# EAGLE design PinscapePico KL25Z Adapter - PCA9555 vsn (EAGLE 7.7.0)

## Sheet 1 of 4: Main
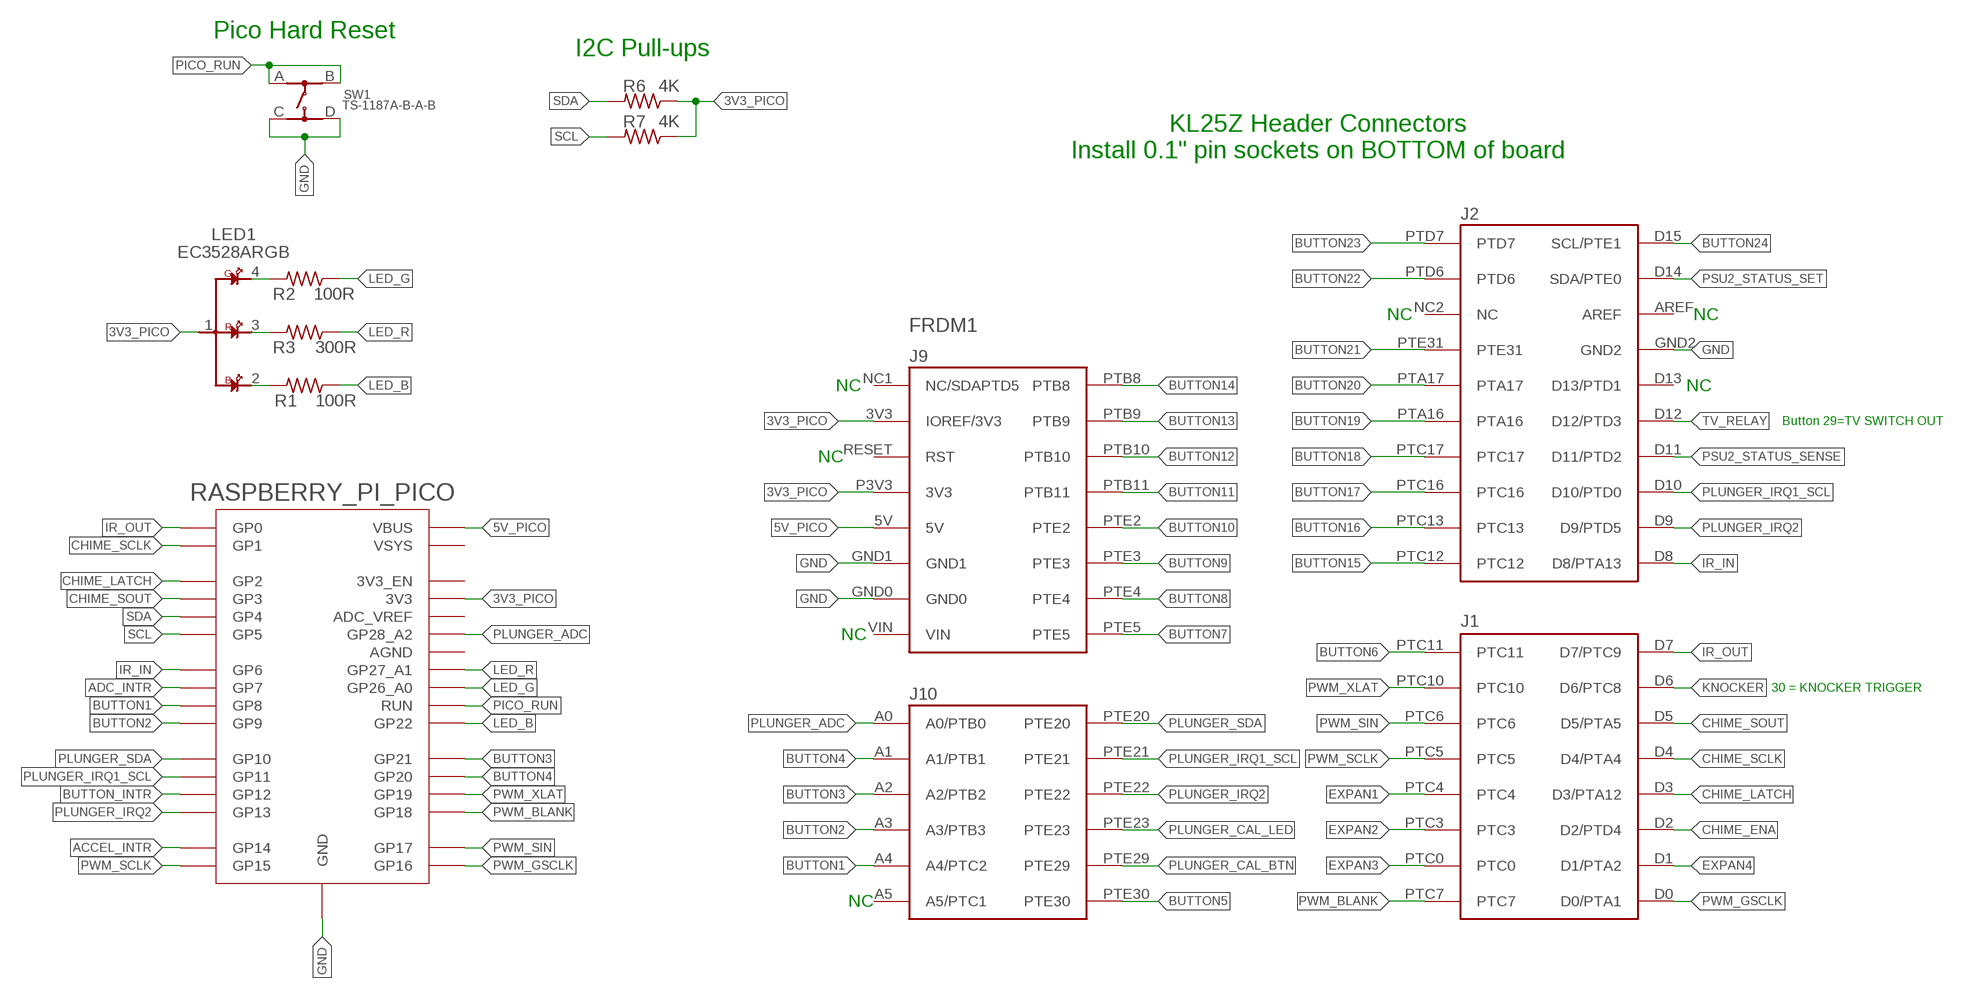
[diagram p0: schematic, sheet 1]

### Parts
FRDM1  KL25Z  FRDM-KL25ZNORMAL  [FRDM_KL25Z_NORMAL]
LED1  EC3528ARGB  [EC3528ARGB]
R1  100R  R-US_R1206  [R1206]
R2  100R  R-US_R1206  [R1206]
R3  300R  R-US_R1206  [R1206]
R6  4K  R-US_R1206  [R1206]
R7  4K  R-US_R1206  [R1206]
RASPBERRY_PI_PICO  RPI_PICO_NO_DEBUG  [RPI_PICO_TH_NO_DEBUG]
SW1  TS-1187A-B-A-B  [TS-1187A-B-A-B]

### Nets
3V3_PICO: FRDM1.3V3(IOREF/3V3) FRDM1.P3V3(3V3) LED1.1 R6.1 R7.1 RASPBERRY_PI_PICO.3V3 ; also sheet 2,3,4
5V_PICO: FRDM1.5V RASPBERRY_PI_PICO.VBUS
ACCEL_INTR: RASPBERRY_PI_PICO.GP14 ; also sheet 3
ADC_INTR: RASPBERRY_PI_PICO.GP7 ; also sheet 4
BUTTON1: FRDM1.A4(A4/PTC2) RASPBERRY_PI_PICO.GP8
BUTTON2: FRDM1.A3(A3/PTB3) RASPBERRY_PI_PICO.GP9
BUTTON3: FRDM1.A2(A2/PTB2) RASPBERRY_PI_PICO.GP21
BUTTON4: FRDM1.A1(A1/PTB1) RASPBERRY_PI_PICO.GP20
BUTTON5: FRDM1.PTE30 ; also sheet 2
BUTTON6: FRDM1.PTC11 ; also sheet 2
BUTTON7: FRDM1.PTE5 ; also sheet 2
BUTTON8: FRDM1.PTE4 ; also sheet 2
BUTTON9: FRDM1.PTE3 ; also sheet 2
BUTTON10: FRDM1.PTE2 ; also sheet 2
BUTTON11: FRDM1.PTB11 ; also sheet 2
BUTTON12: FRDM1.PTB10 ; also sheet 2
BUTTON13: FRDM1.PTB9 ; also sheet 2
BUTTON14: FRDM1.PTB8 ; also sheet 2
BUTTON15: FRDM1.PTC12 ; also sheet 2
BUTTON16: FRDM1.PTC13 ; also sheet 2
BUTTON17: FRDM1.PTC16 ; also sheet 2
BUTTON18: FRDM1.PTC17 ; also sheet 2
BUTTON19: FRDM1.PTA16 ; also sheet 2
BUTTON20: FRDM1.PTA17 ; also sheet 2
BUTTON21: FRDM1.PTE31 ; also sheet 2
BUTTON22: FRDM1.PTD6 ; also sheet 2
BUTTON23: FRDM1.PTD7 ; also sheet 2
BUTTON24: FRDM1.D15(SCL/PTE1) ; also sheet 2
BUTTON_INTR: RASPBERRY_PI_PICO.GP12 ; also sheet 2
CHIME_ENA: FRDM1.D2(D2/PTD4) ; also sheet 2
CHIME_LATCH: FRDM1.D3(D3/PTA12) RASPBERRY_PI_PICO.GP2
CHIME_SCLK: FRDM1.D4(D4/PTA4) RASPBERRY_PI_PICO.GP1
CHIME_SOUT: FRDM1.D5(D5/PTA5) RASPBERRY_PI_PICO.GP3
EXPAN1: FRDM1.PTC4 ; also sheet 2
EXPAN2: FRDM1.PTC3 ; also sheet 2
EXPAN3: FRDM1.PTC0 ; also sheet 2
EXPAN4: FRDM1.D1(D1/PTA2) ; also sheet 2
GND: FRDM1.GND0 FRDM1.GND1 FRDM1.GND2 RASPBERRY_PI_PICO.GND@1(GND) RASPBERRY_PI_PICO.GND@2(GND) RASPBERRY_PI_PICO.GND@3(GND) RASPBERRY_PI_PICO.GND@4(GND) RASPBERRY_PI_PICO.GND@6(GND) RASPBERRY_PI_PICO.GND@7(GND) RASPBERRY_PI_PICO.GND@8(GND) SW1.C SW1.D ; also sheet 2,3,4
IR_IN: FRDM1.D8(D8/PTA13) RASPBERRY_PI_PICO.GP6
IR_OUT: FRDM1.D7(D7/PTC9) RASPBERRY_PI_PICO.GP0
KNOCKER: FRDM1.D6(D6/PTC8) ; also sheet 2
LED_B: R1.1 RASPBERRY_PI_PICO.GP22
LED_G: R2.1 RASPBERRY_PI_PICO.GP26_A0
LED_R: R3.1 RASPBERRY_PI_PICO.GP27_A1
N$8: LED1.3 R3.2
N$10: LED1.2 R1.2
N$13: LED1.4 R2.2
PICO_RUN: RASPBERRY_PI_PICO.RUN SW1.A SW1.B
PLUNGER_ADC: FRDM1.A0(A0/PTB0) RASPBERRY_PI_PICO.GP28_A2 ; also sheet 4
PLUNGER_CAL_BTN: FRDM1.PTE29 ; also sheet 2
PLUNGER_CAL_LED: FRDM1.PTE23 ; also sheet 2
PLUNGER_IRQ1_SCL: FRDM1.D10(D10/PTD0) FRDM1.PTE21 RASPBERRY_PI_PICO.GP11
PLUNGER_IRQ2: FRDM1.D9(D9/PTD5) FRDM1.PTE22 RASPBERRY_PI_PICO.GP13
PLUNGER_SDA: FRDM1.PTE20 RASPBERRY_PI_PICO.GP10
PSU2_STATUS_SENSE: FRDM1.D11(D11/PTD2) ; also sheet 2
PSU2_STATUS_SET: FRDM1.D14(SDA/PTE0) ; also sheet 2
PWM_BLANK: FRDM1.PTC7 RASPBERRY_PI_PICO.GP18
PWM_GSCLK: FRDM1.D0(D0/PTA1) RASPBERRY_PI_PICO.GP16
PWM_SCLK: FRDM1.PTC5 RASPBERRY_PI_PICO.GP15
PWM_SIN: FRDM1.PTC6 RASPBERRY_PI_PICO.GP17
PWM_XLAT: FRDM1.PTC10 RASPBERRY_PI_PICO.GP19
SCL: R7.2 RASPBERRY_PI_PICO.GP5 ; also sheet 2,3,4
SDA: R6.2 RASPBERRY_PI_PICO.GP4 ; also sheet 2,3,4
TV_RELAY: FRDM1.D12(D12/PTD3) ; also sheet 2
Unconnected: FRDM1.A5(A5/PTC1) FRDM1.AREF FRDM1.D13(D13/PTD1) FRDM1.NC1(NC/SDAPTD5) FRDM1.NC2(NC) FRDM1.RESET(RST) FRDM1.VIN RASPBERRY_PI_PICO.3V3_EN RASPBERRY_PI_PICO.ADC_VREF RASPBERRY_PI_PICO.AGND RASPBERRY_PI_PICO.VSYS

### Notes on the sheet
- Pico Hard Reset
- I2C Pull-ups
- KL25Z Header Connectors
  Install 0.1" pin sockets on BOTTOM of board
- NC | NC
- NC | NC
- Button 29=TV SWITCH OUT
- NC
- NC
- 30 = KNOCKER TRIGGER
- NC

## Sheet 2 of 4: Buttons
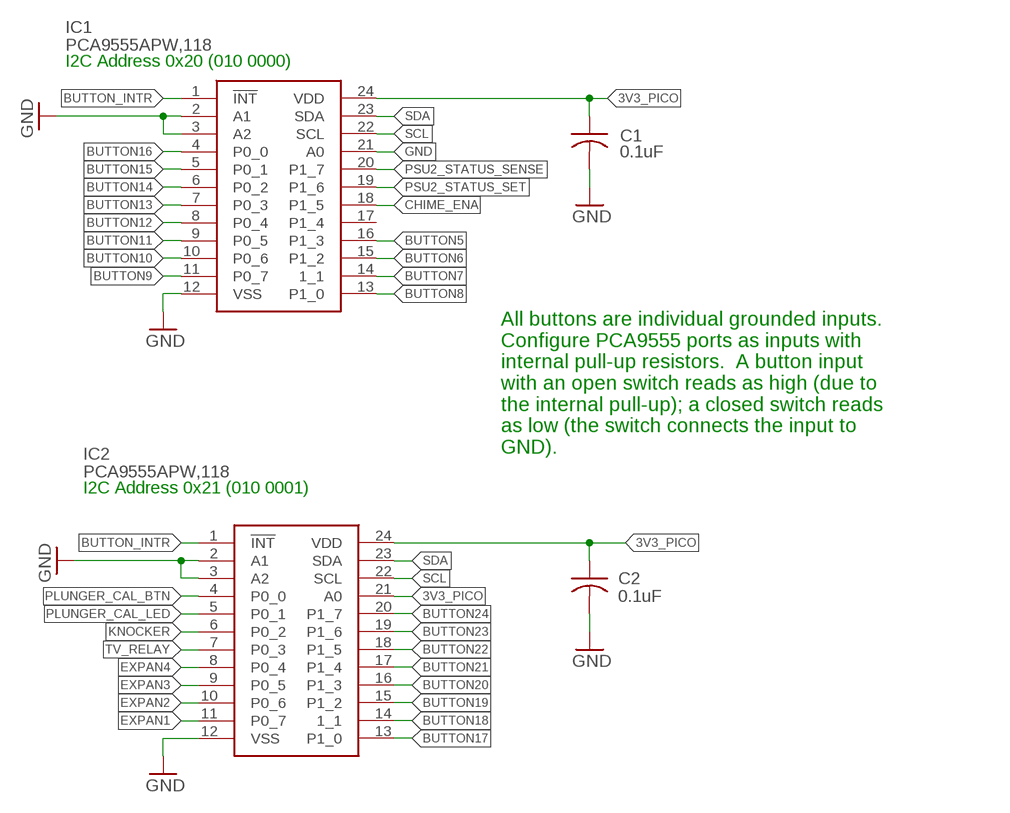
[diagram p1: schematic, sheet 2]

### Parts
C1  0.1uF  C-USC1206  [C1206]
C2  0.1uF  C-USC1206  [C1206]
IC1  PCA9555APW,118  [SOP65P640X110-24N]
IC2  PCA9555APW,118  [SOP65P640X110-24N]

### Nets
3V3_PICO: C1.1 C2.1 IC1.24(VDD) IC2.21(A0) IC2.24(VDD) ; also sheet 1,3,4
BUTTON5: IC1.16(P1_3) ; also sheet 1
BUTTON6: IC1.15(P1_2) ; also sheet 1
BUTTON7: IC1.14(1_1) ; also sheet 1
BUTTON8: IC1.13(P1_0) ; also sheet 1
BUTTON9: IC1.11(P0_7) ; also sheet 1
BUTTON10: IC1.10(P0_6) ; also sheet 1
BUTTON11: IC1.9(P0_5) ; also sheet 1
BUTTON12: IC1.8(P0_4) ; also sheet 1
BUTTON13: IC1.7(P0_3) ; also sheet 1
BUTTON14: IC1.6(P0_2) ; also sheet 1
BUTTON15: IC1.5(P0_1) ; also sheet 1
BUTTON16: IC1.4(P0_0) ; also sheet 1
BUTTON17: IC2.13(P1_0) ; also sheet 1
BUTTON18: IC2.14(1_1) ; also sheet 1
BUTTON19: IC2.15(P1_2) ; also sheet 1
BUTTON20: IC2.16(P1_3) ; also sheet 1
BUTTON21: IC2.17(P1_4) ; also sheet 1
BUTTON22: IC2.18(P1_5) ; also sheet 1
BUTTON23: IC2.19(P1_6) ; also sheet 1
BUTTON24: IC2.20(P1_7) ; also sheet 1
BUTTON_INTR: IC1.1(!INT) IC2.1(!INT) ; also sheet 1
CHIME_ENA: IC1.18(P1_5) ; also sheet 1
EXPAN1: IC2.11(P0_7) ; also sheet 1
EXPAN2: IC2.10(P0_6) ; also sheet 1
EXPAN3: IC2.9(P0_5) ; also sheet 1
EXPAN4: IC2.8(P0_4) ; also sheet 1
GND: C1.2 C2.2 IC1.2(A1) IC1.3(A2) IC1.12(VSS) IC1.21(A0) IC2.2(A1) IC2.3(A2) IC2.12(VSS) ; also sheet 1,3,4
KNOCKER: IC2.6(P0_2) ; also sheet 1
PLUNGER_CAL_BTN: IC2.4(P0_0) ; also sheet 1
PLUNGER_CAL_LED: IC2.5(P0_1) ; also sheet 1
PSU2_STATUS_SENSE: IC1.20(P1_7) ; also sheet 1
PSU2_STATUS_SET: IC1.19(P1_6) ; also sheet 1
SCL: IC1.22(SCL) IC2.22(SCL) ; also sheet 1,3,4
SDA: IC1.23(SDA) IC2.23(SDA) ; also sheet 1,3,4
TV_RELAY: IC2.7(P0_3) ; also sheet 1
Unconnected: IC1.17(P1_4)

### Notes on the sheet
- I2C Address 0x20 (010 0000)
- All buttons are individual grounded inputs.
  Configure PCA9555 ports as inputs with
  internal pull-up resistors.  A button input
  with an open switch reads as high (due to
  the internal pull-up); a closed switch reads
  as low (the switch connects the input to
  GND).
- I2C Address 0x21 (010 0001)

## Sheet 3 of 4: Accelerometer
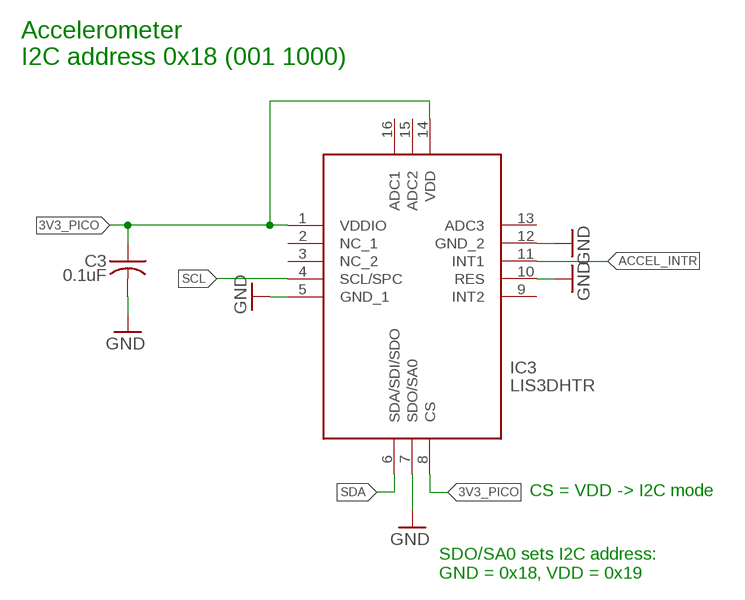
[diagram p2: schematic, sheet 3]

### Parts
C3  0.1uF  C-USC1206  [C1206]
IC3  LIS3DHTR  [LIS3DHTR]

### Nets
3V3_PICO: C3.1 IC3.1(VDDIO) IC3.8(CS) IC3.14(VDD) ; also sheet 1,2,4
ACCEL_INTR: IC3.11(INT1) ; also sheet 1
GND: C3.2 IC3.5(GND_1) IC3.7(SDO/SA0) IC3.10(RES) IC3.12(GND_2) ; also sheet 1,2,4
SCL: IC3.4(SCL/SPC) ; also sheet 1,2,4
SDA: IC3.6(SDA/SDI/SDO) ; also sheet 1,2,4
Unconnected: IC3.2(NC_1) IC3.3(NC_2) IC3.9(INT2) IC3.13(ADC3) IC3.15(ADC2) IC3.16(ADC1)

### Notes on the sheet
- Accelerometer
  I2C address 0x18 (001 1000)
- CS = VDD -> I2C mode
- SDO/SA0 sets I2C address:
  GND = 0x18, VDD = 0x19

## Sheet 4 of 4: ADC
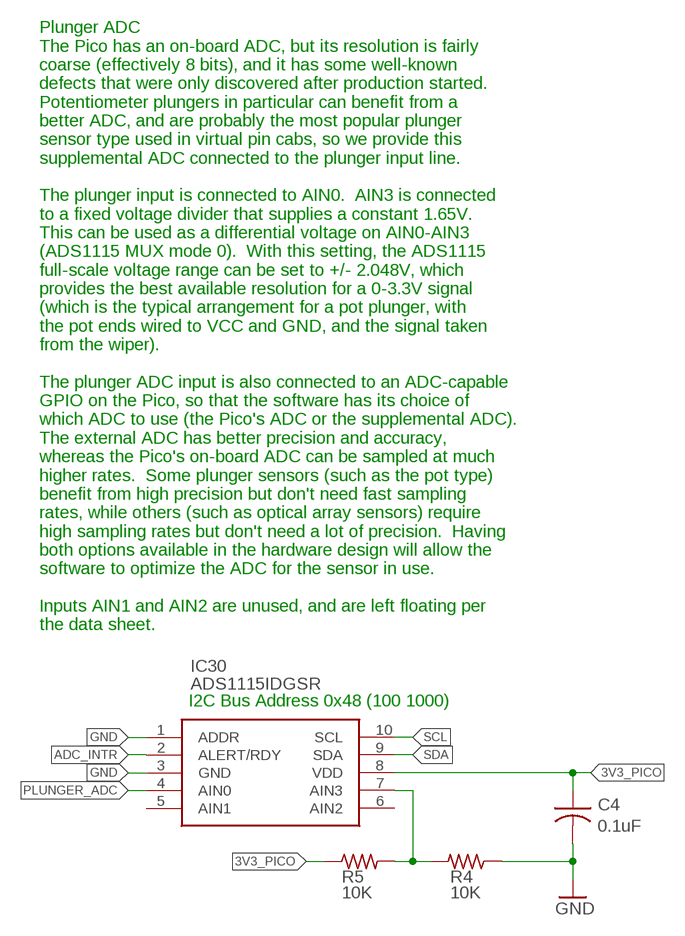
[diagram p3: schematic, sheet 4]

### Parts
C4  0.1uF  C-USC1206  [C1206]
IC30  ADS1115IDGSR  [SOP50P490X110-10N]
R4  10K  R-US_R1206  [R1206]
R5  10K  R-US_R1206  [R1206]

### Nets
3V3_PICO: C4.1 IC30.8(VDD) R5.1 ; also sheet 1,2,3
ADC_INTR: IC30.2(ALERT/RDY) ; also sheet 1
GND: C4.2 IC30.1(ADDR) IC30.3(GND) R4.1 ; also sheet 1,2,3
N$71: IC30.7(AIN3) R4.2 R5.2
PLUNGER_ADC: IC30.4(AIN0) ; also sheet 1
SCL: IC30.10(SCL) ; also sheet 1,2,3
SDA: IC30.9(SDA) ; also sheet 1,2,3
Unconnected: IC30.5(AIN1) IC30.6(AIN2)

### Notes on the sheet
- Plunger ADC
  The Pico has an on-board ADC, but its resolution is fairly
  coarse (effectively 8 bits), and it has some well-known
  defects that were only discovered after production started.
  Potentiometer plungers in particular can benefit from a
  better ADC, and are probably the most popular plunger
  sensor type used in virtual pin cabs, so we provide this
  supplemental ADC connected to the plunger input line.
  
  The plunger input is connected to AIN0.  AIN3 is connected
  to a fixed voltage divider that supplies a constant 1.65V.
  This can be used as a differential voltage on AIN0-AIN3
  (ADS1115 MUX mode 0).  With this setting, the ADS1115
  full-scale voltage range can be set to +/- 2.048V, which
  provides the best available resolution for a 0-3.3V signal
  (which is the typical arrangement for a pot plunger, with
  the pot ends wired to VCC and GND, and the signal taken
  from the wiper).
  
  The plunger ADC input is also connected to an ADC-capable
  GPIO on the Pico, so that the software has its choice of
  which ADC to use (the Pico's ADC or the supplemental ADC).
  The external ADC has better precision and accuracy,
  whereas the Pico's on-board ADC can be sampled at much
  higher rates.  Some plunger sensors (such as the pot type)
  benefit from high precision but don't need fast sampling
  rates, while others (such as optical array sensors) require
  high sampling rates but don't need a lot of precision.  Having
  both options available in the hardware design will allow the
  software to optimize the ADC for the sensor in use.
  
  Inputs AIN1 and AIN2 are unused, and are left floating per
  the data sheet.
- I2C Bus Address 0x48 (100 1000)

## Library data of the parts
C1-C4 = rcl:C-US: CAPACITOR, American symbol
FRDM1 = kl25z:FRDM-KL25Z: For creating FRDM-KL25Z shields
IC1 IC2 = SamacSys_Parts:PCA9555APW,118: NXP - PCA9555APW,118 - I/O EXPANDER, 16BIT, 400KHZ, TSSOP-24 Source: Datasheet <http://www.nxp.com/docs/en/data-sheet/PCA9555A.pdf>; DESCRIPTION: NXP - PCA9555APW,118 - I/O EXPANDER, 16BIT, 400KHZ, TSSOP-24; HEIGHT: 1.1mm; MANUFACTURER_NAME: NXP; MANUFACTURER_PART_NUMBER: PCA9555APW,118; MOUSER_PART_NUMBER: 771-PCA9555APW118; MOUSER_PRICE-STOCK: https://www.mouser.co.uk/ProductDetail/NXP-Semiconductors/PCA9555APW118?qs=5C9Q4QJFsuPmpoGpn%2FKoIQ%3D%3D
IC3 = SamacSys_Parts:LIS3DHTR: Accelerometer 3-Axis 2g/16g 1.8V LGA16 STMicroelectronics LIS3DHTR Accelerometer IC, 3-axis, I2C, SPI 1.71 3.6 V, 16-Pin LGA Source: Datasheet <http://www.st.com/content/ccc/resource/technical/document/datasheet/3c/ae/50/85/d6/b1/46/fe/CD00274221.pdf/files/CD00274221.pdf/jcr:content/translations/en.CD00274221.pdf>; DESCRIPTION: Accelerometer 3-Axis 2g/16g 1.8V LGA16 STMicroelectronics LIS3DHTR Accelerometer IC, 3-axis, I2C, SPI 1.71 3.6 V, 16-Pin LGA; HEIGHT: 1mm; MANUFACTURER_NAME: STMicroelectronics; MANUFACTURER_PART_NUMBER: LIS3DHTR; MOUSER_PART_NUMBER: 511-LIS3DHTR; MOUSER_PRICE-STOCK: https://www.mouser.co.uk/ProductDetail/STMicroelectronics/LIS3DHTR?qs=6la6oa3D8xzhXYax3cEo4w%3D%3D
IC30 = SamacSys_Parts:ADS1115IDGSR: 16-Bit 860SPS 4-Ch Delta-Sigma ADC With PGA, Oscillator, Vref, Comparator, and I2C Source: Datasheet <http://www.ti.com/lit/gpn/ADS1115>; DESCRIPTION: 16-Bit 860SPS 4-Ch Delta-Sigma ADC With PGA, Oscillator, Vref, Comparator, and I2C; HEIGHT: 1.1mm; MANUFACTURER_NAME: Texas Instruments; MANUFACTURER_PART_NUMBER: ADS1115IDGSR; MOUSER_PART_NUMBER: 595-ADS1115IDGSR; MOUSER_PRICE-STOCK: https://www.mouser.co.uk/ProductDetail/Texas-Instruments/ADS1115IDGSR?qs=IK5e5L0zOXjKCJoVMhYO%2FQ%3D%3D
LED1 = SamacSys_Parts:EC3528ARGB: EC3528ARGB RGB LED, 5mA, common anode, SMD 3528 package; Dongguan Ousike Optoelectronics Technology Co., Ltd.
R1-R7 = resistor:R-US_: RESISTOR, American symbol
RASPBERRY_PI_PICO = RaspberryPi_Pico:RPI_PICO_NO_DEBUG
SW1 = SamacSys_Parts:TS-1187A-B-A-B

## Board
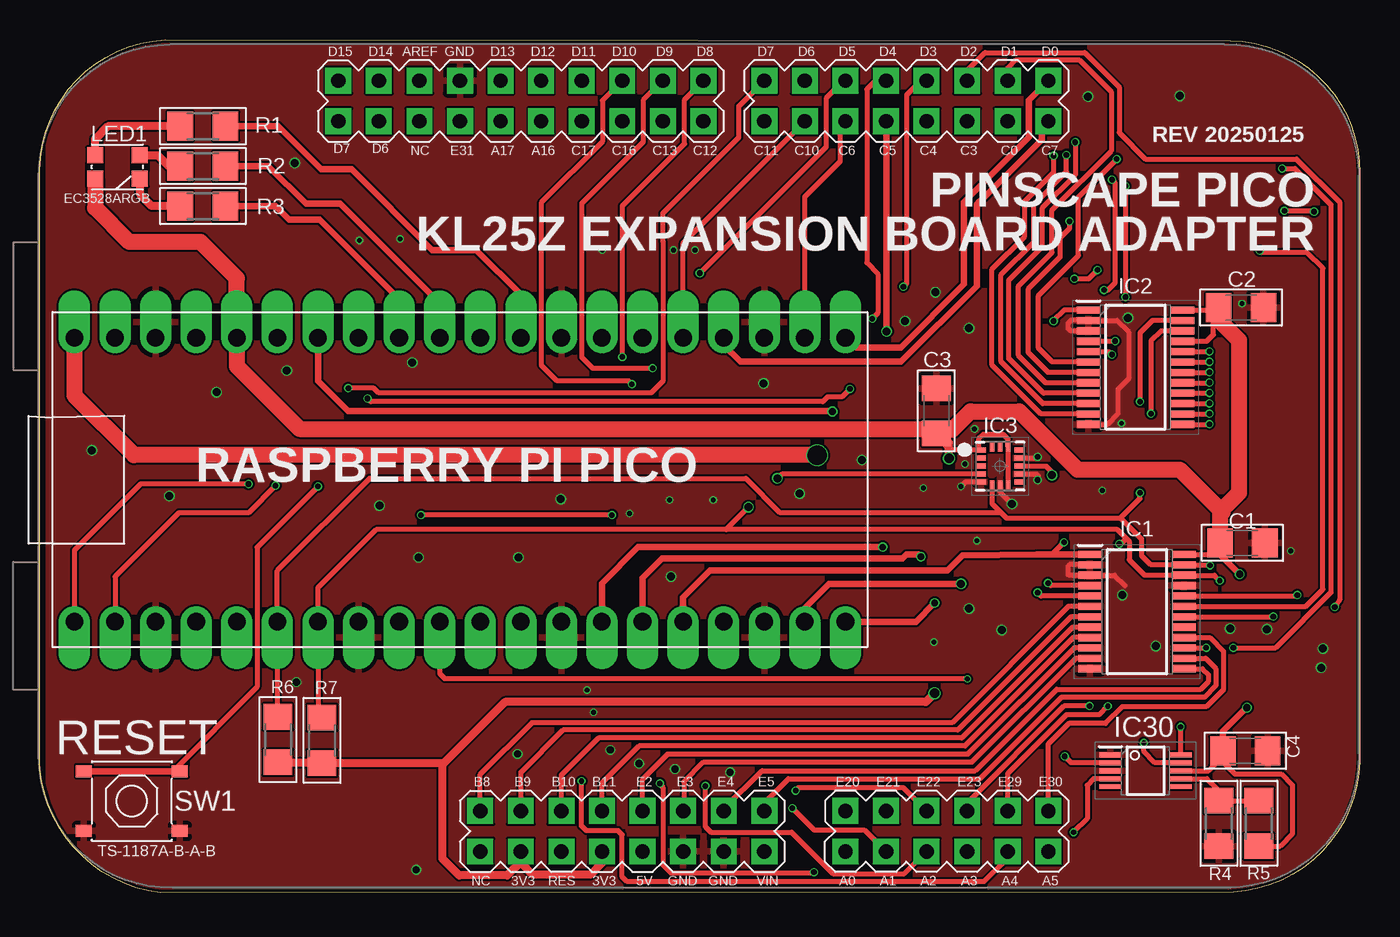
[diagram p4: board, top side]
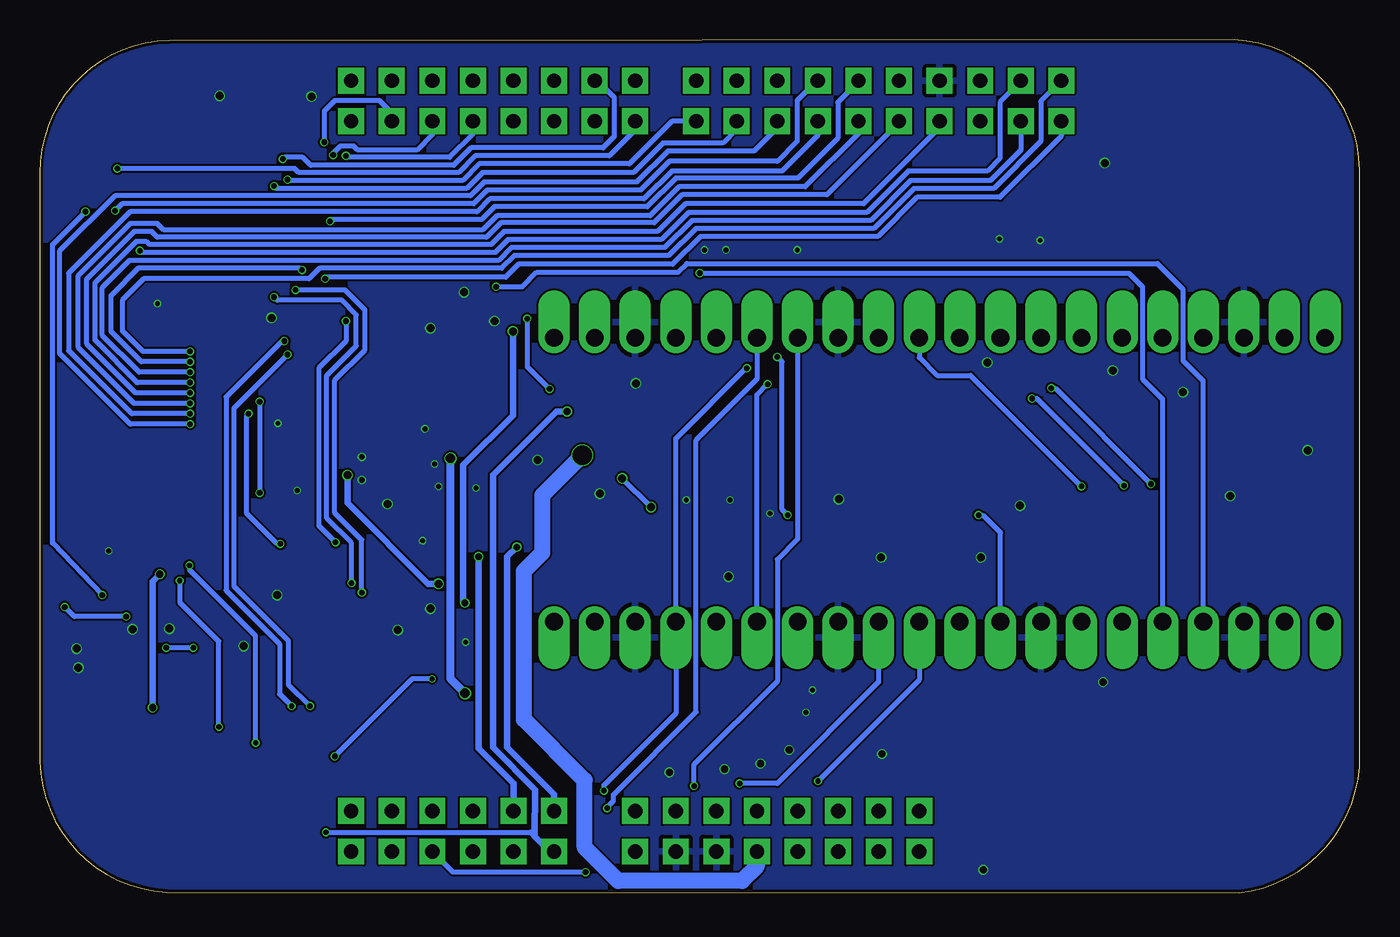
[diagram p5: board, bottom side, seen from below]

Size 82.6 x 53.4 mm. Coordinates in mm from the lower left corner, seen from the top.
Outline: 7.85,53.4 74.5,53.35 arc-90 82.6,45.05 82.6,8.25 arc-86 74.7,0.05 7.55,0 arc-79 0,7.9 0,45.25 arc-87 7.85,53.4
Copper layers (1*16): Top 0.035mm / dielectric 1.6mm / Bottom 0.035mm
Design rules "jlcpcb-2layers": minimum track width 5mil, minimum drill 0.3mm, track to track 5mil, track to pad 5mil, pad to pad 5mil, via to via 5mil, smd to smd 5mil, copper to edge 0.2mm, drill to drill 6mil, minimum pad ring 10mil, minimum via ring 3mil, stop-mask expansion 4mil, vias tented up to drill 0mil, thermal gap 10mil

### Footprints (pad centres in the part's own frame; a part is rotated, then mirrored left to right if it is on the bottom)
C1206 = smd 1.6 x 1.8: 1 -1.4,0; 2 1.4,0
FRDM_KL25Z_NORMAL = drill 0.9 square: 3V3 24.13,-15.24; 5V 24.13,-7.62; A0 24.13,5.08; A1 24.13,7.62; A2 24.13,10.16; A3 24.13,12.7; A4 24.13,15.24; A5 24.13,17.78; AREF -24.13,-21.59; D0 -24.13,17.78; D1 -24.13,15.24; D2 -24.13,12.7; D3 -24.13,10.16; D4 -24.13,7.62; D5 -24.13,5.08; D6 -24.13,2.54; D7 -24.13,0; D8 -24.13,-3.81; D9 -24.13,-6.35; D10 -24.13,-8.89; D11 -24.13,-11.43; D12 -24.13,-13.97; D13 -24.13,-16.51; D14 -24.13,-24.13; D15 -24.13,-26.67; GND0 24.13,-2.54; GND1 24.13,-5.08; GND2 -24.13,-19.05; NC1 24.13,-17.78; NC2 -21.59,-21.59; P3V3 24.13,-10.16; PTA16 -21.59,-13.97; PTA17 -21.59,-16.51; PTB8 21.59,-17.78; PTB9 21.59,-15.24; PTB10 21.59,-12.7; PTB11 21.59,-10.16; PTC0 -21.59,15.24; PTC3 -21.59,12.7; PTC4 -21.59,10.16; PTC5 -21.59,7.62; PTC6 -21.59,5.08; PTC7 -21.59,17.78; PTC10 -21.59,2.54; PTC11 -21.59,0; PTC12 -21.59,-3.81; PTC13 -21.59,-6.35; PTC16 -21.59,-8.89; PTC17 -21.59,-11.43; PTD6 -21.59,-24.13; PTD7 -21.59,-26.67; PTE2 21.59,-7.62; PTE3 21.59,-5.08; PTE4 21.59,-2.54; PTE5 21.59,0; PTE20 21.59,5.08; PTE21 21.59,7.62; PTE22 21.59,10.16; PTE23 21.59,12.7; PTE29 21.59,15.24; PTE30 21.59,17.78; PTE31 -21.59,-19.05; RESET 24.13,-12.7; VIN 24.13,0
SOP65P640X110-24N = smd 1.475 x 0.45: 1 -2.938,3.575; 2 -2.938,2.925; 3 -2.938,2.275; 4 -2.938,1.625; 5 -2.938,0.975; 6 -2.938,0.325; 7 -2.938,-0.325; 8 -2.938,-0.975; 9 -2.938,-1.625; 10 -2.938,-2.275; 11 -2.938,-2.925; 12 -2.938,-3.575; 13 2.938,-3.575; 14 2.938,-2.925; 15 2.938,-2.275; 16 2.938,-1.625; 17 2.938,-0.975; 18 2.938,-0.325; 19 2.938,0.325; 20 2.938,0.975; 21 2.938,1.625; 22 2.938,2.275; 23 2.938,2.925; 24 2.938,3.575
LIS3DHTR = smd 0.6 x 0.3: 1 -1.2,1; 2 -1.2,0.5; 3 -1.2,0; 4 -1.2,-0.5; 5 -1.2,-1; 9 1.2,-1; 10 1.2,-0.5; 11 1.2,0; 12 1.2,0.5; 13 1.2,1 | smd 0.3 x 0.6: 6 -0.5,-1.2; 7 0,-1.2; 8 0.5,-1.2; 14 0.5,1.2; 15 0,1.2; 16 -0.5,1.2
SOP50P490X110-10N = smd 1.4 x 0.3: 1 -2.2,1; 2 -2.2,0.5; 3 -2.2,0; 4 -2.2,-0.5; 5 -2.2,-1; 6 2.2,-1; 7 2.2,-0.5; 8 2.2,0; 9 2.2,0.5; 10 2.2,1
EC3528ARGB = smd 1 x 1: 1 -0.725,1.4; 2 0.725,1.4; 3 -0.725,-1.4; 4 0.725,-1.4
R1206 = smd 1.6 x 1.803: 1 -1.422,0; 2 1.422,0
RPI_PICO_TH_NO_DEBUG = drill 1.1 pad 1.6 offset: 3V3 8.89,13.97; 3V3_EN 8.89,16.51; ADC_VREF 8.89,11.43; AGND 8.89,6.35; GND@1 -8.89,19.05; GND@2 -8.89,6.35; GND@3 -8.89,-6.35; GND@4 -8.89,-19.05; GND@6 8.89,-19.05; GND@7 8.89,-6.35; GND@8 8.89,19.05; GP0 -8.89,24.13; GP1 -8.89,21.59; GP2 -8.89,16.51; GP3 -8.89,13.97; GP4 -8.89,11.43; GP5 -8.89,8.89; GP6 -8.89,3.81; GP7 -8.89,1.27; GP8 -8.89,-1.27; GP9 -8.89,-3.81; GP10 -8.89,-8.89; GP11 -8.89,-11.43; GP12 -8.89,-13.97; GP13 -8.89,-16.51; GP14 -8.89,-21.59; GP15 -8.89,-24.13; GP16 8.89,-24.13; GP17 8.89,-21.59; GP18 8.89,-16.51; GP19 8.89,-13.97; GP20 8.89,-11.43; GP21 8.89,-8.89; GP22 8.89,-3.81; GP26_A0 8.89,1.27; GP27_A1 8.89,3.81; GP28_A2 8.89,8.89; RUN 8.89,-1.27; VBUS 8.89,24.13; VSYS 8.89,21.59
TS-1187A-B-A-B = smd 1 x 0.75: A -3,1.875; B 3,1.875; C -3,-1.875; D 3,-1.875

### Placement (x,y rotation side)
C1  75.27,21.91 0 top
C2  75.18,36.65 0 top
C3  56.11,30.18 90 top
C4  75.45,8.9 0 top
FRDM1  45.34,26.72 270 top
IC1  68.67,17.61 0 top
IC2  68.57,32.91 0 top
IC3  60.1,26.72 0 top
IC30  69.2,7.65 0 top
LED1  4.85,45.45 90 top
R1  10.2,48 180 top
R2  10.2,45.5 180 top
R3  10.2,43 180 top
R4  73.8,4.35 90 top
R5  76.3,4.35 90 top
R6  14.9,9.6 90 top
R7  17.65,9.55 90 top
RASPBERRY_PI_PICO  26.29,25.87 90 top
SW1  5.75,5.75 0 top

### Tracks (layer width: path | path; a pad name or v marks a point on that pad's centre or on a via)
3V3_PICO  (via drill 0.45, 0.6)
  Top 0.3: IC1.24 73.84,21.19 C1.1 | IC2.24 73.49,36.48 C2.1 73.45,36.37 73.45,34.95 73.03,34.53 IC2.21 | C3.1 56.87,27.72 IC3.1 58.75,27.87 58.75,28.4 59.05,28.7 60.3,28.7 60.6,28.4 IC3.14 IC3.8 | IC30.8 73.15,7.65 74.05,8.55 | 74.05,8.55 C4.1 | 76.3,2.5 R5.1 77.63,2.93 78.4,3.7 78.4,6.75 77.7,7.45 74.8,7.45 74.05,8.2 74.05,8.55
  Top 0.4: C4.1 74.05,10.1 v75.55,11.6 | v75.1,19.95 75.1,19.93 73.84,21.19
  Top 0.5: FRDM1.P3V3 35.18,1.88 34.45,1.15 30.85,1.15 30.1,1.9 FRDM1.3V3 30.1,1.95 29.25,1.1 26.25,1.1 25.2,2.15 25.2,8.05 | 25.2,8.05 29.1,11.95 55.45,11.95 v56,12.5 | v56.9,27.2 56.9,28.17 C3.1 | R6.1 17.6,8.18 R7.1 25.12,8.13 25.2,8.05
  Top 1: 73.87,23.97 71.34,26.5 64.95,26.5 61.3,30.15 58.25,30.15 57.1,29 55.6,29 | 73.87,23.97 73.92,23.92 | 73.92,23.92 74.02,23.82 | C1.1 73.87,23.97 | C3.1 56.07,28.53 55.6,29 | 55.6,29 55.55,29.05 16.25,29.05 12.32,32.98 RASPBERRY_PI_PICO.3V3 12.32,38.48 10.05,40.75 5.6,40.75 3.45,42.9 LED1.1 | C2.1 73.78,35.87 75.05,34.6 75.05,25.05 73.92,23.92
  Bottom 0.4: v75.55,11.6 75.55,19.5 v75.1,19.95
  Bottom 0.5: v56.9,27.2 56.9,13.4 v56,12.5
5V_PICO  (via drill 1.2)
  Top 1: v48.65,27.4 5.9,27.4 2.16,31.14 RASPBERRY_PI_PICO.VBUS
  Bottom 1: FRDM1.5V 37.72,1.68 38.65,0.75 46.4,0.75 48.5,2.85 48.5,7.05 52.3,10.85 52.3,20.15 51.15,21.3 51.15,24.9 v48.65,27.4
ACCEL_INTR  (via drill 0.5)
  Top 0.3: IC3.11 62.98,26.72 63.35,26.35 v63.35,26.15
  Top 0.4: v57.65,19.35 49.4,19.35 47.88,17.83 RASPBERRY_PI_PICO.GP14
  Bottom 0.4: v63.35,26.15 63.35,24.4 58.3,19.35 v57.65,19.35
ADC_INTR  (via drill 0.3, 0.35)
  Top 0.3: IC30.2 64.55,8.15 v64.15,8.55 | v58.05,13.4 25.35,13.4 25.02,13.73 RASPBERRY_PI_PICO.GP7
  Bottom 0.3: v64.15,8.55 59.3,13.4 v58.05,13.4
BUTTON1  (via drill 0.33)
  Top 0.3: FRDM1.A4 60.58,2.18 59.1,0.7 36.75,0.7 36.45,1 36.45,3.65 36.2,3.9 34.2,3.9 33.9,4.2 v33.9,7
  Bottom 0.3: RASPBERRY_PI_PICO.GP8 27.56,13.34 v33.9,7
BUTTON2  (via drill 0.35)
  Top 0.3: v38.8,6.85 38.8,6.8 39,6.6 39,1.75 39.5,1.25 48.4,1.25 v48.45,1.3
  Bottom 0.3: RASPBERRY_PI_PICO.GP9 30.1,13.2 36.45,6.85 v38.8,6.85 | v48.45,1.3 56.75,1.3 FRDM1.A3
BUTTON3  (via drill 0.35)
  Top 0.3: FRDM1.A2 54.11,1.2 49.65,1.2 47.05,3.8 42,3.8 41.65,4.15 v41.65,6.7
  Bottom 0.3: RASPBERRY_PI_PICO.GP21 35.18,22.15 36.45,20.88 36.45,13.25 41.65,8.05 v41.65,6.7
BUTTON4  (via drill 0.35)
  Top 0.3: v47.1,5.3 48.45,3.95 51.6,3.95 FRDM1.A1
  Bottom 0.3: v47.1,5.3 47.1,5.35 46.7,5.75 46.7,6.15 41.53,11.32 41.53,28.35 37.72,32.16 RASPBERRY_PI_PICO.GP20
BUTTON5
  Top 0.3: IC1.16 73.21,15.99 74.1,15.1 74.1,12.75 73,11.65 67.75,11.65 66.7,10.6 64.4,10.6 63.12,9.32 FRDM1.PTE30
BUTTON6  (via drill 0.35)
  Top 0.3: v77.75,45.35 78.55,45.35 80.8,43.1 80.8,18.8 77.35,15.35 v74.7,15.35 | IC1.15 72.98,15.34 v73,15.35
  Bottom 0.3: FRDM1.PTC11 45.34,47.76 46.95,46.15 55.35,46.15 56.4,45.1 66.4,45.1 66.65,45.35 v77.75,45.35 | v73,15.35 v74.7,15.35
BUTTON7
  Top 0.3: FRDM1.PTE5 45.34,5.64 46.85,7.15 58.85,7.15 63.95,12.25 72.9,12.25 73.6,12.95 73.6,14.05 72.96,14.69 IC1.14
BUTTON8
  Top 0.3: FRDM1.PTE4 42.8,5.25 45.2,7.65 58.55,7.65 63.65,12.75 72.65,12.75 73.15,13.25 73.15,13.65 72.77,14.04 IC1.13
BUTTON9
  Top 0.3: IC1.11 64.83,14.69 58.35,8.2 41.55,8.2 40.3,6.95 40.3,5.17 FRDM1.PTE3
BUTTON10
  Top 0.3: FRDM1.PTE2 37.72,7.12 39.3,8.7 58.1,8.7 64.73,15.34 IC1.10
BUTTON11
  Top 0.3: FRDM1.PTB11 35.18,6.88 37.5,9.2 57.9,9.2 64.68,15.99 IC1.9
BUTTON12
  Top 0.3: FRDM1.PTB10 32.64,7.39 34.95,9.7 57.7,9.7 64.63,16.64 IC1.8
BUTTON13
  Top 0.3: FRDM1.PTB9 30.1,7.55 32.75,10.2 57.45,10.2 64.53,17.29 IC1.7
BUTTON14
  Top 0.3: FRDM1.PTB8 27.56,7.41 30.8,10.65 57.1,10.65 64.38,17.94 IC1.6
BUTTON15  (via drill 0.35)
  Top 0.3: IC1.5 62.66,18.59 v62.45,18.8 | v66.6,37.75 66.85,37.75 67.3,38.2 67.3,44.45 v67.1,44.65
  Bottom 0.3: FRDM1.PTC12 43.04,48.31 45.7,45.65 55.1,45.65 56.15,44.6 67.05,44.6 v67.1,44.65 | v62.45,18.8 62.45,22.1 64.15,23.8 64.15,32.1 62.25,34 62.25,36.5 63.5,37.75 v66.6,37.75
BUTTON16  (via drill 0.35)
  Top 0.3: IC1.4 63.27,19.23 v63.1,19.4 | v67.95,44.25 v67.95,37.3
  Bottom 0.3: FRDM1.PTC13 38.99,47.81 39.85,46.95 43.6,46.95 45.45,45.1 54.9,45.1 55.9,44.1 67.8,44.1 v67.95,44.25 | v63.1,19.4 63.1,21.9 64.65,23.45 64.65,32.4 62.8,34.25 62.8,36.2 63.7,37.1 67.75,37.1 v67.95,37.3
BUTTON17  (via drill 0.35)
  Top 0.3: IC2.13 73.18,29.34 v73.2,29.35
  Bottom 0.3: FRDM1.PTC16 36.45,47.9 37.9,46.45 43.3,46.45 45.25,44.5 54.8,44.5 55.65,43.65 77.9,43.65 81.35,40.2 81.35,33.75 76.95,29.35 v73.2,29.35
BUTTON18  (via drill 0.35)
  Top 0.3: IC2.14 73.18,29.98 v73.2,30
  Bottom 0.3: FRDM1.PTC17 33.91,47.44 36.15,45.2 43.05,45.2 44.8,43.45 54.45,43.45 55.25,42.65 76.95,42.65 80.8,38.8 80.8,33.95 76.85,30 v73.2,30
BUTTON19  (via drill 0.35)
  Top 0.3: IC2.15 73.18,30.64 v73.2,30.65
  Bottom 0.3: FRDM1.PTA16 31.37,47.53 34.7,44.2 42.6,44.2 44.4,42.4 54,42.4 54.9,41.5 74.85,41.5 75.25,41.9 76.95,41.9 80.2,38.65 80.2,34.15 76.7,30.65 v73.2,30.65
BUTTON20  (via drill 0.35)
  Top 0.3: IC2.16 73.18,31.29 v73.2,31.3
  Bottom 0.3: FRDM1.PTA17 28.83,48.22 33.35,43.7 42.4,43.7 44.15,41.95 53.75,41.95 54.65,41.05 75.25,41.05 75.6,41.4 76.7,41.4 79.7,38.4 79.7,34.4 76.6,31.3 v73.2,31.3
BUTTON21  (via drill 0.35)
  Top 0.3: IC2.17 73.18,31.94 v73.2,31.95
  Bottom 0.3: FRDM1.PTE31 26.29,47.91 31.05,43.15 42.2,43.15 43.95,41.4 53.55,41.4 54.35,40.6 75.75,40.6 75.95,40.8 76.55,40.8 79.15,38.2 79.15,34.6 76.5,31.95 v73.2,31.95
BUTTON22  (via drill 0.35)
  Top 0.3: IC2.18 73.18,32.58 v73.2,32.6
  Bottom 0.3: FRDM1.PTD6 21.21,46.49 23.1,44.6 28.1,44.6 30.6,42.1 41.8,42.1 43.5,40.4 53.1,40.4 53.9,39.6 77,39.6 78.7,37.9 78.7,34.9 76.4,32.6 v73.2,32.6
BUTTON23  (via drill 0.35)
  Top 0.3: v64.75,38.45 65.65,38.45 v66.2,39 | IC2.19 73.18,33.23 v73.2,33.25
  Bottom 0.3: FRDM1.PTD7 18.67,47.38 22.5,43.55 27.7,43.55 30.15,41.1 41.25,41.1 43,39.35 52.65,39.35 53.45,38.55 64.7,38.55 v64.75,38.45 | v66.2,39 66.3,39.1 76.45,39.1 78.15,37.4 78.15,35.15 76.25,33.25 v73.2,33.25
BUTTON24  (via drill 0.35)
  Top 0.3: IC2.20 73.18,33.88 v73.2,33.9
  Bottom 0.3: FRDM1.D15 18.67,50.83 19.95,49.55 19.95,47.05 22.9,44.1 27.9,44.1 30.4,41.6 41.55,41.6 43.25,39.9 52.9,39.9 53.7,39.1 65.1,39.1 65.75,38.45 76.1,38.45 77.45,37.1 77.45,35.2 76.15,33.9 v73.2,33.9
BUTTON_INTR  (via drill 0.35)
  Top 0.3: IC2.1 64.08,36.48 63.45,35.85 v63.45,35.8 | 62.4,21.19 63.34,21.19 v64.1,21.95
  Top 0.4: RASPBERRY_PI_PICO.GP12 40.26,18.51 41.95,20.2 56.8,20.2 57.73,21.14 62.4,21.19 IC1.1
  Bottom 0.3: v63.45,35.8 63.45,34.55 65.15,32.85 65.15,23 v64.1,21.95
CHIME_ENA  (via drill 0.35)
  Top 0.3: FRDM1.D2 58.04,51.49 59.15,52.6 65.4,52.6 67.55,50.45 67.55,47.6 69.2,45.95 78.65,45.95 81.35,43.25 81.35,18.35 v81.05,17.9 | IC1.18 77.18,17.29 v77.2,17.3
  Bottom 0.3: v77.2,17.3 80.45,17.3 v81.05,17.9
CHIME_LATCH  (via drill 0.35)
  Top 0.3: FRDM1.D3 55.15,50.85 54.25,49.95 54.25,38.15 v54.05,37.95
  Bottom 0.3: RASPBERRY_PI_PICO.GP2 9.78,32.05 11.05,33.32 11.05,37.8 12.65,39.4 42.1,39.4 42.65,38.85 51.5,38.85 52.4,37.95 v54.05,37.95
CHIME_SCLK  (via drill 0.35)
  Top 0.3: FRDM1.D4 52.3,50.85 51.75,50.3 51.75,39.45 52.45,38.75 52.45,36.3 v52.1,35.95 | v50.7,31.55 50.2,31.05 49.3,31.05 49,30.75 20.7,30.75 v20.5,30.95 | RASPBERRY_PI_PICO.GP1 4.7,19.8 8.7,23.8 13.05,23.8 v14.75,25.5
  Bottom 0.3: v52.1,35.95 52.1,32.95 v50.7,31.55 | v20.5,30.95 20.2,30.95 v14.75,25.5
CHIME_SOUT  (via drill 0.35)
  Top 0.25: FRDM1.D5 50.3,50.85
  Top 0.3: 50.3,50.85 49.2,49.75 49.2,46.7 v41.3,38.8
  Bottom 0.3: RASPBERRY_PI_PICO.GP3 12.32,30.9 13.59,32.17 13.59,37.95 14.44,38.8 v41.3,38.8
EXPAN1  (via drill 0.35)
  Top 0.3: IC2.11 62.66,29.98 59.6,33.05 59.6,39.05 61.65,41.1 61.65,43.3 63.45,45.1 v63.45,46.15
  Bottom 0.3: FRDM1.PTC4 55.5,47.5 56.95,46.05 63.35,46.05 v63.45,46.15
EXPAN2  (via drill 0.35)
  Top 0.3: IC2.10 62.77,30.64 60.15,33.25 60.15,38.7 62.2,40.75 62.2,43.1 64.25,45.15 v64.25,46.2
  Bottom 0.3: FRDM1.PTC3 58.04,47.46 59,46.5 62.7,46.5 62.95,46.75 63.8,46.75 64.25,46.3 v64.25,46.2
EXPAN3  (via drill 0.35)
  Top 0.3: IC2.9 62.82,31.29 60.65,33.45 60.65,38.35 62.75,40.45 62.75,42.9 64.8,44.95 v64.8,47
  Bottom 0.3: FRDM1.PTC0 60.58,48.83 61.35,49.6 64.15,49.6 64.8,48.95 v64.8,47
EXPAN4
  Top 0.3: IC2.8 62.97,31.94 61.25,33.65 61.25,38 63.35,40.1 63.35,42.75 67.05,46.45 67.05,50.15 65.05,52.15 61.1,52.15 60.58,51.63 FRDM1.D1
GND  (via drill 0.3, 0.35, 0.45, 0.5)
  Top 0.3: 60.6,24.6 v60.85,24.35 60.1,25.1 IC3.7 | IC3.5 57.92,25.72 v57.65,25.45 | IC3.12 62.38,27.22 v62.45,27.3 | IC3.10 62.38,26.22 62.45,26.15 v62.45,25.85 | IC1.2 65.75,20.55 64.45,20.55 64.35,20.45 64.35,19.95 64.41,19.89 IC1.3 67.27,19.89 67.91,19.23 | IC2.3 64.52,35.18 64.35,35.35 64.35,35.65 64.55,35.85 65.62,35.85 IC2.2 67.41,35.83 68.15,35.1 68.15,32.2 67.5,31.55 67.5,30 66.83,29.34 IC2.12
  other vias: 39.4,24.6 76.8,16.5 22.55,40.95 58.15,17.8 47.55,25 32.6,24.65 23.3,33.2 15.45,32.7 11.05,31.35 3.25,27.7 23.7,21 51.45,27.1 56.05,37.6 54.15,35.8 15.95,45.7 21.25,24.25 8.1,24.85 39.5,19.8 29.95,21 43.2,7.55 23.55,1.45 37.5,8.1 34.65,11.3 29.9,8.7 75.25,36.9 78.3,21.4 58.5,29.05 45.3,31.9 74.5,16.55 60.2,16.45 80.3,15.3 80.2,14.1 35.7,8.95 39.75,7.75 65.6,49.85 68.1,36 67.75,18.65 69.85,15.45 20,40.85 58.15,35.35 58.65,22.05 57.9,26.85 16.05,13.2 36.9,23.75 42.15,24.6 35.2,40.25 39.65,40.25 41,40.25 71.35,49.9 34.25,12.7 55.95,15.7 55.3,25.35 67.7,29.4 66.5,25.2
  pour Top: 0.55,53.45 82.25,53.45 82.25,0.15 0.55,0.15
  pour Bottom: 0.55,53.45 82.25,53.45 82.25,0.25 0.55,0.25
IR_IN  (via drill 0.35)
  Top 0.3: FRDM1.D8 40.35,49.67 40.35,46.9 36.45,43 v36.45,33.55 | v35.8,23.65 v23.85,23.65
  Bottom 0.3: RASPBERRY_PI_PICO.GP6 22.48,22.55 23.58,23.65 v23.85,23.65 | 35.9,23.65 v35.8,23.65 36.15,24 36.15,33.25 v36.45,33.55
IR_OUT  (via drill 0.35)
  Top 0.3: FRDM1.D7 43.75,49.26 43.75,47.3 39,42.55 38.99,40.8 38.99,32.04 38.25,31.3 21.2,31.3 20.9,31.6 v19.3,31.6 | v13.05,25.6 6.31,25.6 2.16,21.45 RASPBERRY_PI_PICO.GP0
  Bottom 0.3: v19.3,31.6 19.05,31.6 v13.05,25.6
KNOCKER  (via drill 0.35)
  Top 0.3: IC2.6 63.37,33.23 62.5,34.1 62.5,37.4 65,39.9 65,43.55 v67.4,45.95
  Bottom 0.3: FRDM1.D6 47.7,50.85 46.65,49.8 46.65,47.35 47.35,46.65 55.6,46.65 56.7,45.55 65.65,45.55 66.15,46.05 67.3,46.05 v67.4,45.95
LED_B
  Top 0.406: RASPBERRY_PI_PICO.GP22 30.1,37.45 27.3,40.25 24.55,40.25 19.5,45.3 17.6,45.3 14.9,48 R1.1
LED_G
  Top 0.406: RASPBERRY_PI_PICO.GP26_A0 25.02,36.93 18.8,43.15 16.65,43.15 14.3,45.5 R2.1
LED_R
  Top 0.406: RASPBERRY_PI_PICO.GP27_A1 22.48,37.17 17.5,42.15 15.6,42.15 14.75,43 R3.1
N$8
  Top 0.5: LED1.3 6.25,43.75 7,43 R3.2
N$10
  Top 0.5: R1.2 4.25,48 3.45,47.2 LED1.2
N$13
  Top 0.5: LED1.4 7.38,46.17 8.05,45.5 R2.2
N$71
  Top 0.3: IC30.7 73.05,7.15 73.65,6.55 73.65,5.92 R4.2 R5.2
PICO_RUN  (via drill 0.35)
  Top 0.3: 6.79,7.62 8.32,7.62 13.59,12.89 13.59,21.64 v17.4,25.45
  Top 0.406: SW1.A 6.79,7.62 SW1.B
  Bottom 0.3: RASPBERRY_PI_PICO.RUN 27.56,33.51 26.45,32.4 24.35,32.4 v17.4,25.45
PLUNGER_ADC  (via drill 0.33, 0.45)
  Top 0.3: IC30.4 65.95,7.15 65.55,6.75 65.55,4.65 v64.7,3.8
  Top 0.4: RASPBERRY_PI_PICO.GP28_A2 17.4,32.06 19.29,30.17 49.59,30.17 v49.61,30.14
  Bottom 0.3: v64.7,3.8 51.9,3.8 51.65,3.55
  Bottom 0.4: FRDM1.A0 50.69,2.59 51.65,3.55 51.6,6.45 54.25,9.1 54.25,26.15 50.26,30.14 v49.61,30.14
PLUNGER_CAL_BTN  (via drill 0.33, 0.35)
  Top 0.3: IC2.4 67.21,34.53 v67.3,34.55 | FRDM1.PTE29 60.58,7.48 64.25,11.15 66.3,11.15 v66.85,11.7
  Bottom 0.3: v67.3,34.55 67.45,34.55 70.95,31.05 70.95,18.95 67.6,15.6 67.6,12.45 v66.85,11.7
PLUNGER_CAL_LED  (via drill 0.35)
  Top 0.3: IC2.5 66.91,33.88 v67.1,33.7 | FRDM1.PTE23 58.04,5.64 64.1,11.7 v65.7,11.7
  Bottom 0.3: v67.1,33.7 70.45,30.35 70.45,19.2 67.05,15.8 67.05,13.05 v65.7,11.7
PLUNGER_IRQ1_SCL  (via drill 0.35, 0.42)
  Top 0.3: FRDM1.D10 35.2,49.6 35.2,47.04 31.37,43.21 31.37,33.05 32.37,32.05 36.85,32.05 v37.05,31.85
  Top 0.4: RASPBERRY_PI_PICO.GP11 37.72,19.72 38.95,20.95 54,20.95 54.25,21.2 55,21.2 v55.15,21.05
  Bottom 0.3: RASPBERRY_PI_PICO.GP11 37.72,31.18 v37.05,31.85
  Bottom 0.4: FRDM1.PTE21 52.96,6.86 55.15,9.05 v55.15,21.05
PLUNGER_IRQ2  (via drill 0.35)
  Top 0.3: FRDM1.PTE22 54.03,6.6 47.5,6.6 v47.3,6.4 | FRDM1.D9 37.76,49.62 37.76,47.01 33.91,43.16 33.91,33.54 34.6,32.85 v38.35,32.85
  Top 0.4: FRDM1.PTE22 55.5,5.1
  Bottom 0.3: v47.3,6.4 47.3,6.75 42.8,11.25 RASPBERRY_PI_PICO.GP13 42.8,28.45 38.4,32.85 v38.35,32.85
PLUNGER_SDA  (via drill 0.42)
  Top 0.4: v52.75,21.65 37.45,21.65 35.18,19.38 RASPBERRY_PI_PICO.GP10
  Bottom 0.4: FRDM1.PTE20 50.42,6.17 53.35,9.1 53.35,21.05 v52.75,21.65
PSU2_STATUS_SENSE  (via drill 0.35)
  Top 0.3: IC1.20 78.63,18.59 v78.7,18.65 | v77.9,42.7 79.7,42.7 v79.75,42.65
  Bottom 0.3: FRDM1.D11 33.95,50.85 35.2,49.6 35.2,47.05 36.45,45.8 43.2,45.8 45,44 54.6,44 55.45,43.15 77.45,43.15 v77.9,42.7 | v78.7,18.65 81.8,21.9 81.8,40.6 v79.75,42.65
PSU2_STATUS_SET  (via drill 0.35)
  Top 0.3: IC1.19 79.23,17.94 80.3,19 80.3,39.1 79.3,40.1 76.45,40.1 v76.35,40.2
  Bottom 0.3: FRDM1.D14 21.21,50.79 22.5,49.5 22.5,46 23.3,45.2 28.25,45.2 30.85,42.6 42,42.6 43.7,40.9 53.3,40.9 54.1,40.1 76.25,40.1 v76.35,40.2
PWM_BLANK
  Top 0.4: RASPBERRY_PI_PICO.GP18 42.8,34.3 43.85,33.25 53.9,33.25 58.65,38 58.65,43.1 58.85,43.3 59.2,43.65 62.7,47.15 62.7,47.89 FRDM1.PTC7
PWM_GSCLK
  Top 0.4: RASPBERRY_PI_PICO.GP16 50.49,34.76 51.1,34.15 53.9,34.15 57.85,38.1 57.85,43.25 61.9,47.3 61.9,49.63 FRDM1.D0
PWM_SCLK  (via drill 0.42, 0.5)
  Top 0.4: 55.68,17.83 v56,18.15 54.83,16.98 RASPBERRY_PI_PICO.GP15 | v53,35.15 53,48.27 FRDM1.PTC5
  Bottom 0.4: v53,35.15 53,29.9 56.1,26.8 56.1,18.25 v56,18.15
PWM_SIN
  Top 0.3: RASPBERRY_PI_PICO.GP17 47.88,43.58 50.1,45.8 50.1,47.99 FRDM1.PTC6
PWM_XLAT
  Top 0.3: RASPBERRY_PI_PICO.GP19 40.26,40.69 FRDM1.PTC10
SCL  (via drill 0.33, 0.35, 0.5)
  Top 0.3: IC3.4 46.45,26.22 v46.15,25.95 | 68,22.2 67.45,22.75 42.95,22.75 | 68,22.2 68.19,22.01 68.19,20.86 69.16,19.89 IC1.22 73.52,19.89 v73.85,19.55 | IC2.22 70.18,35.18 69.55,34.55 v69.55,30 | v67.55,21.85 67.65,21.85 68,22.2 | 42.95,22.75 21.05,22.75 17.42,19.12 17.4,19.12 RASPBERRY_PI_PICO.GP5 17.4,11.22 R7.2 | v44.35,24.15 42.95,22.75 | IC30.10 v71.4,10.4
  Bottom 0.3: v44.35,24.15 v46.15,25.95 | v67.55,21.85 67.75,21.85 69.65,23.75 69.65,29.9 v69.55,30 | v71.4,10.4 71.4,15.75 73.85,18.2 v73.85,19.55
SDA  (via drill 0.33, 0.35)
  Top 0.3: IC3.6 59.6,24.37 60.14,23.83 | 60.14,23.83 60.5,23.47 67.63,23.47 | 67.63,23.47 68.97,22.13 68.97,21.11 69.54,20.54 IC1.23 73.21,20.54 v73.25,20.5 | 60.14,23.83 46.3,23.83 44.18,25.95 20.63,25.95 14.86,20.18 RASPBERRY_PI_PICO.GP4 14.86,11.06 R6.2 | IC2.23 69.63,35.83 68.85,35.05 v68.85,30.75 | 67.63,23.47 68.85,24.69 v68.85,25.05 | IC30.9 69.8,8.15 69.1,8.85 v69.1,9.4
  Bottom 0.3: v68.85,30.75 v68.85,25.05 v68.85,25.04 | v69.1,9.4 69.1,16.1 73.25,20.25 v73.25,20.5
TV_RELAY  (via drill 0.35)
  Top 0.3: IC2.7 63.12,32.58 61.85,33.85 61.85,37.8 63.85,39.8 63.85,41 64.45,41.6 v64.45,42.05
  Bottom 0.3: FRDM1.D12 31.37,50.78 32.65,49.5 32.65,47.25 35.15,44.75 42.8,44.75 44.6,42.95 54.2,42.95 54.2,42.9 54.95,42.15 64.35,42.15 v64.45,42.05

### Text on the board
tNames: REV 20250125 | PINSCAPE PICO / KL25Z EXPANSION BOARD ADAPTER | RASPBERRY PI PICO | RESET